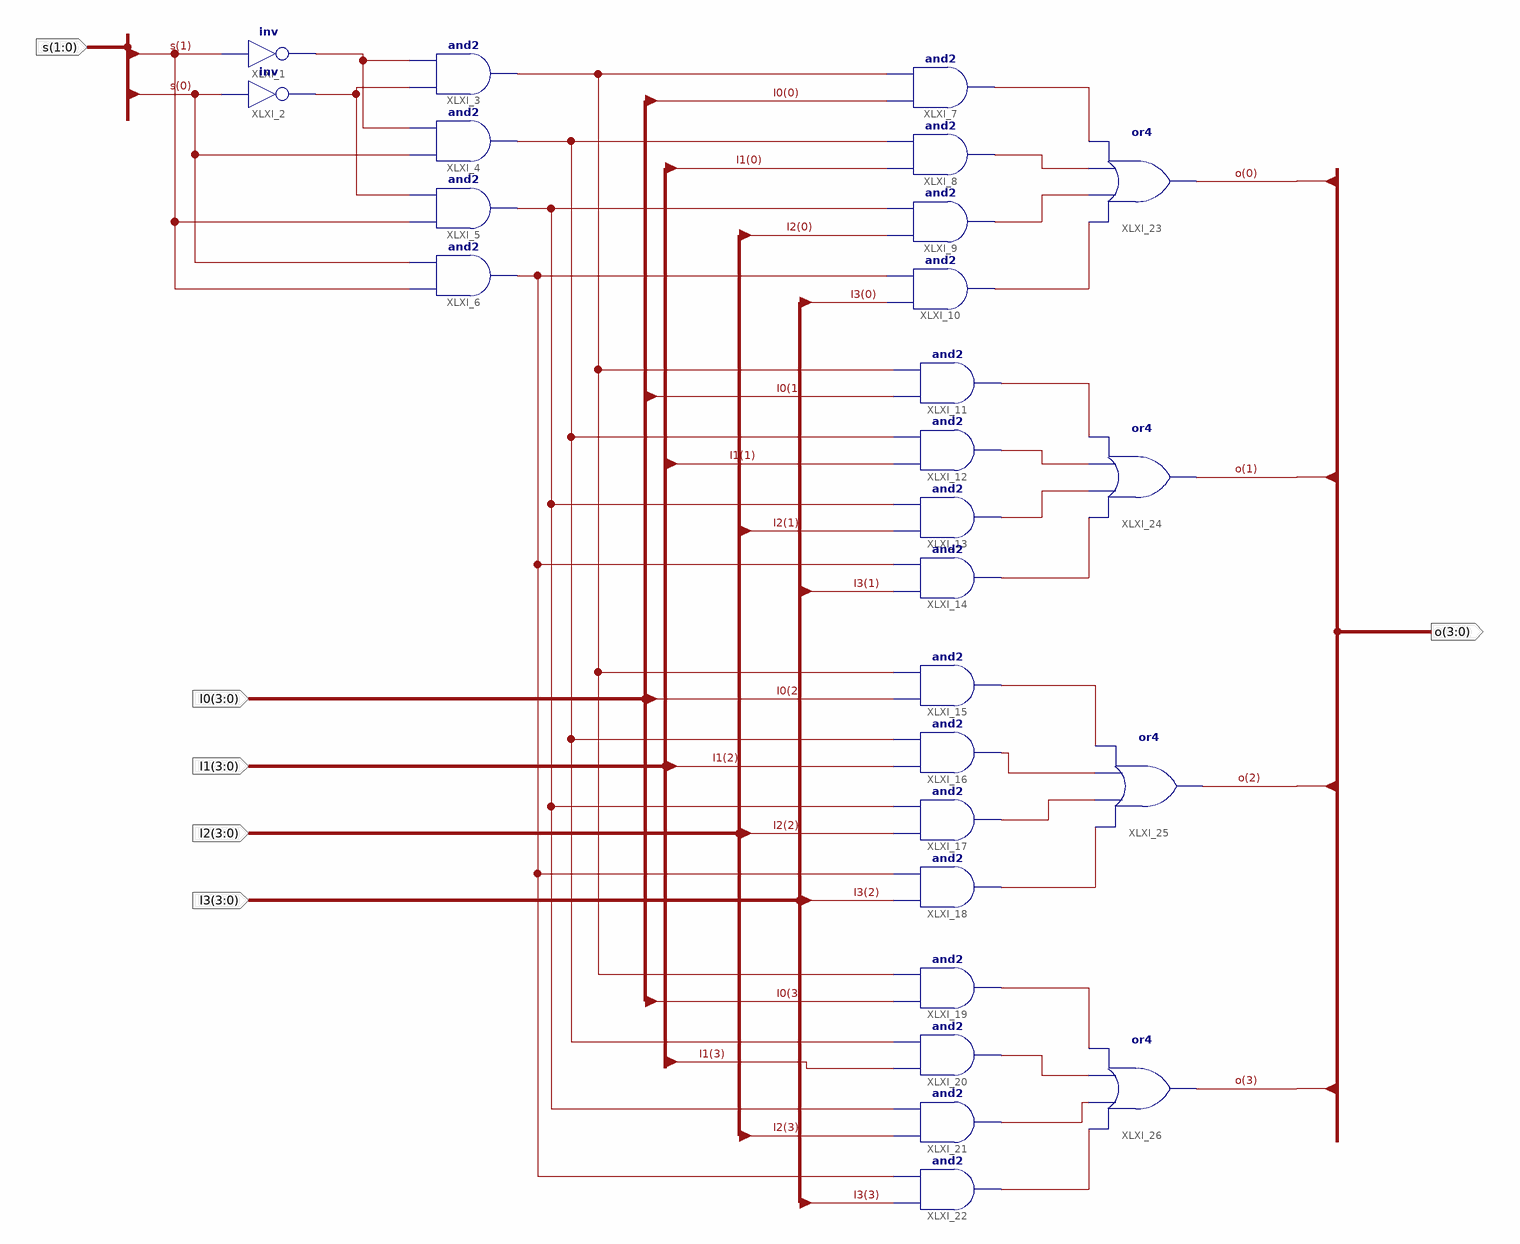
[diagram p0: schematic sheet 1]
// Xilinx ISE schematic Mux4to1b4.sch (kintex7) as structural Verilog: 26 symbols, 6 ports
module Mux4to1b4 (
  input  [1:0] s,
  input  [3:0] I1,
  input  [3:0] I2,
  input  [3:0] I3,
  input  [3:0] I0,
  output [3:0] o
);

  wire XLXN_7, XLXN_8, XLXN_12, XLXN_13, XLXN_14, XLXN_15, XLXN_67, XLXN_68, XLXN_69, XLXN_70, XLXN_71,
       XLXN_72, XLXN_73, XLXN_74, XLXN_75, XLXN_77, XLXN_78, XLXN_79, XLXN_80, XLXN_81, XLXN_82, XLXN_83;

  not XLXI_1 (XLXN_7, s[1]);
  not XLXI_2 (XLXN_8, s[0]);
  and XLXI_3 (XLXN_12, XLXN_8, XLXN_7);
  and XLXI_4 (XLXN_13, s[0], XLXN_7);
  and XLXI_5 (XLXN_14, s[1], XLXN_8);
  and XLXI_6 (XLXN_15, s[1], s[0]);
  and XLXI_7 (XLXN_67, I0[0], XLXN_12);
  and XLXI_8 (XLXN_68, I1[0], XLXN_13);
  and XLXI_9 (XLXN_69, I2[0], XLXN_14);
  and XLXI_10 (XLXN_70, I3[0], XLXN_15);
  and XLXI_11 (XLXN_71, I0[1], XLXN_12);
  and XLXI_12 (XLXN_72, I1[1], XLXN_13);
  and XLXI_13 (XLXN_73, I2[1], XLXN_14);
  and XLXI_14 (XLXN_74, I3[1], XLXN_15);
  and XLXI_15 (XLXN_75, I0[2], XLXN_12);
  and XLXI_16 (XLXN_77, I1[2], XLXN_13);
  and XLXI_17 (XLXN_78, I2[2], XLXN_14);
  and XLXI_18 (XLXN_79, I3[2], XLXN_15);
  and XLXI_19 (XLXN_80, I0[3], XLXN_12);
  and XLXI_20 (XLXN_81, I1[3], XLXN_13);
  and XLXI_21 (XLXN_82, I2[3], XLXN_14);
  and XLXI_22 (XLXN_83, I3[3], XLXN_15);
  or XLXI_23 (o[0], XLXN_70, XLXN_69, XLXN_68, XLXN_67);
  or XLXI_24 (o[1], XLXN_74, XLXN_73, XLXN_72, XLXN_71);
  or XLXI_25 (o[2], XLXN_79, XLXN_78, XLXN_77, XLXN_75);
  or XLXI_26 (o[3], XLXN_83, XLXN_82, XLXN_81, XLXN_80);
endmodule
